# EAGLE schematic control (EAGLE 7.6.0)
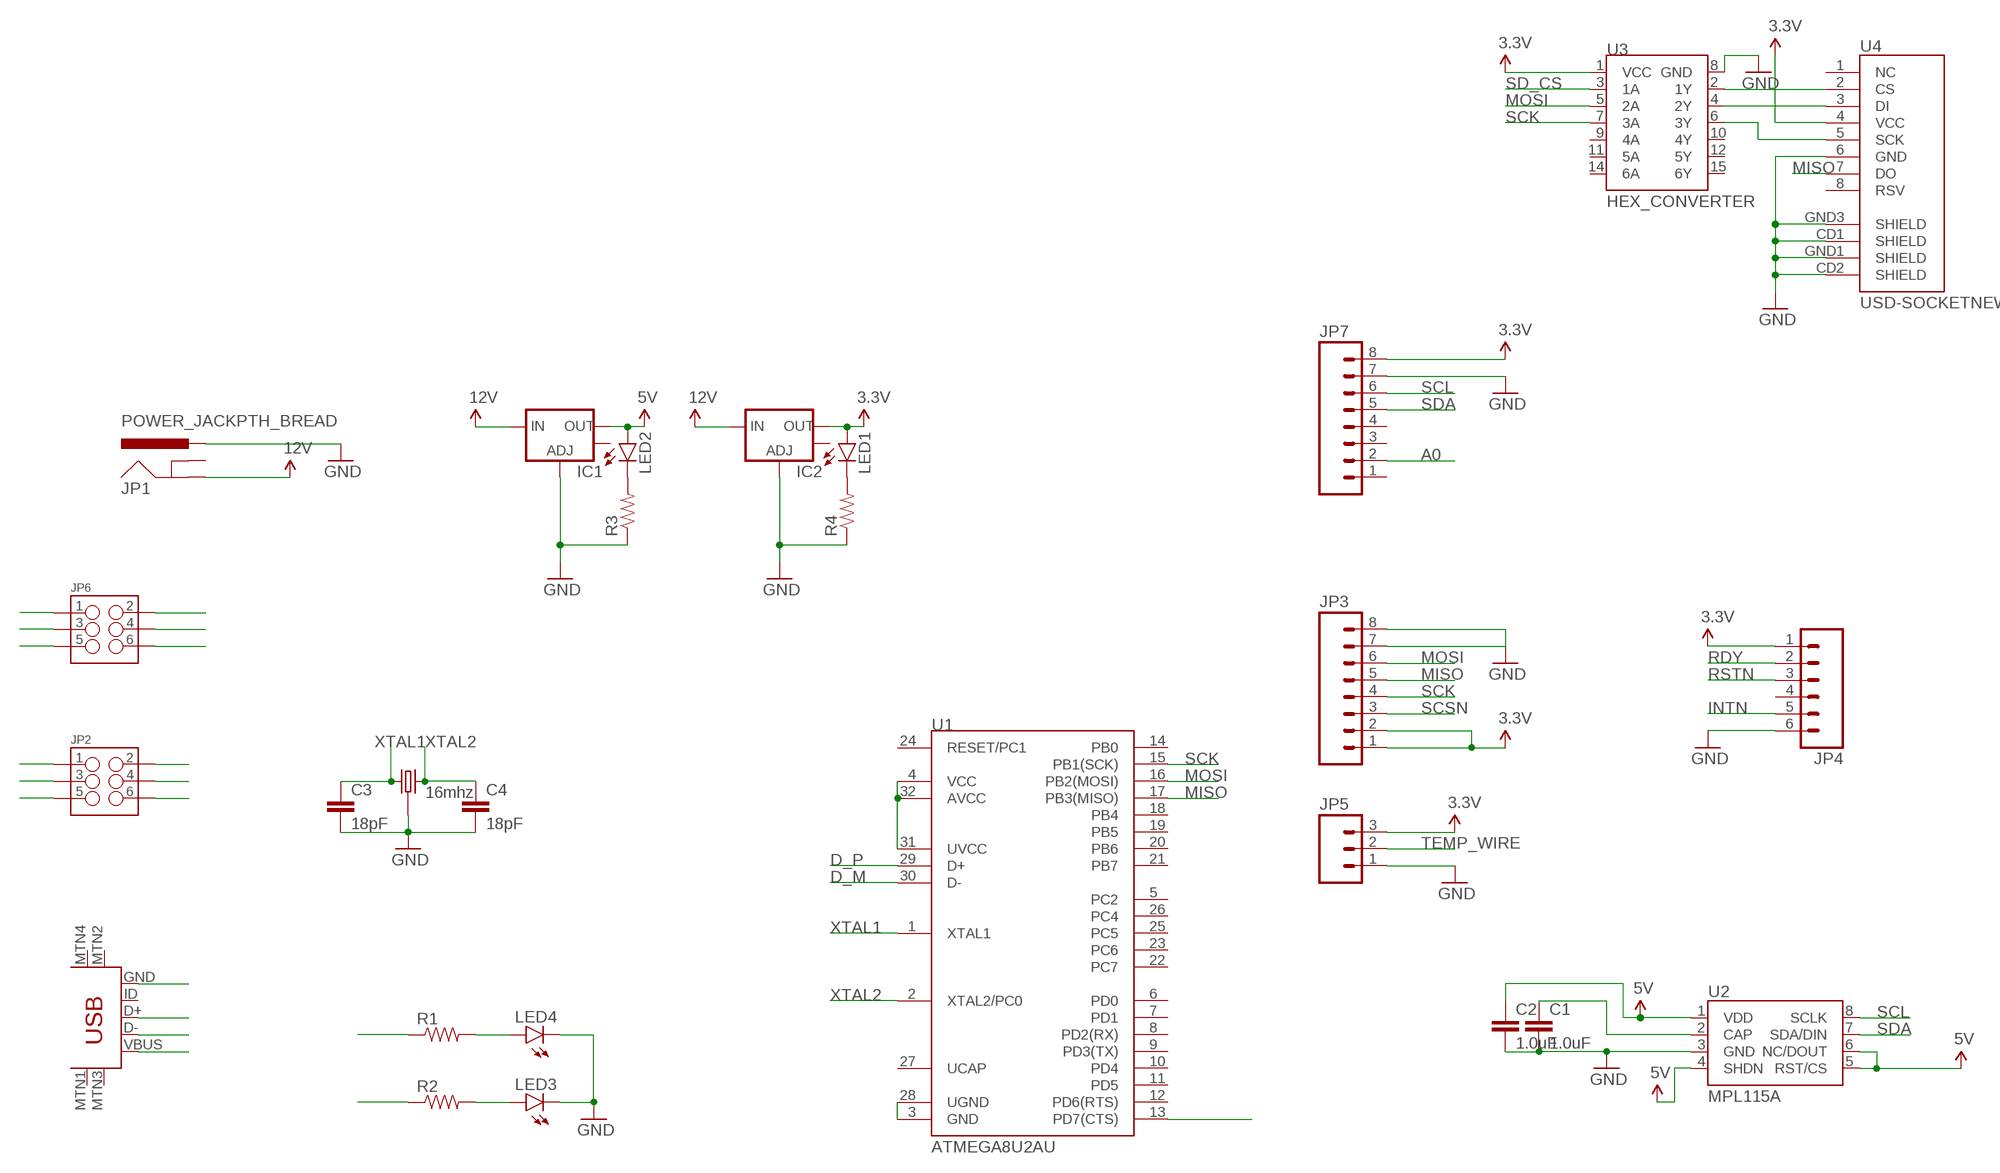
[diagram p0: schematic, sheet 1]

## Parts
C1  1.0uF  1.0UF-16V-10%(0603)  [0603-CAP]
C2  1.0uF  1.0UF-16V-10%(0603)  [0603-CAP]
C3  18pF  18PF-50V-5%(0603)  [0603-CAP]
C4  18pF  18PF-50V-5%(0603)  [0603-CAP]
IC1  V_REG_LM1117SOT223  [SOT223]
IC2  V_REG_LM1117SOT223  [SOT223]
JP1  POWER_JACKPTH_BREAD  [POWER_JACK_PTH_BREAD]
JP2  M03X2SHROUD  [2X3-SHROUDED]
JP3  M08  [1X08_ROUND]
JP4  M06SILK_FEMALE_PTH  [1X06]
JP5  M03PTH  [1X03]
JP6  M03X2SHROUD  [2X3-SHROUDED]
JP7  M08  [1X08_ROUND]
LED1  LED0603  [LED-0603]
LED2  LED0603  [LED-0603]
LED3  LED0603  [LED-0603]
LED4  LED0603  [LED-0603]
R1  RESISTOR0603-RES  [0603-RES]
R2  RESISTOR0603-RES  [0603-RES]
R3  RESISTOR0603-RES  [0603-RES]
R4  RESISTOR0603-RES  [0603-RES]
U1  ATMEGA8U2AU  [TQFP32-08]
U2  MPL115A  [LGA8]
U3  HEX_CONVERTER  [SO016]
U4  USD-SOCKETNEW  [MICRO-SD-SOCKET-PP]
U$3  16mhz  CRYSTAL-GROUNDED  [CRYSTAL-SMD-5X3]
U$5  USB-MINIB-5PIN  [USB-MINIB]

## Nets
3.3V: IC2.2(OUT) JP3.1 JP3.2 JP4.1 JP5.3 JP7.8 LED1.A U3.1(VCC) U4.4(VCC)
5V: C2.1 IC1.2(OUT) LED2.A U2.1(VDD) U2.4(SHDN) U2.5(RST/CS) U2.6(NC/DOUT)
12V: IC1.3(IN) IC2.3(IN) JP1.GND
A0: JP7.2
D_M: U1.30(D-)
D_P: U1.29(D+)
GND: C1.2 C2.2 C3.2 C4.2 IC1.1(ADJ) IC2.1(ADJ) JP1.PWR JP4.6 JP5.1 JP7.7 LED3.C LED4.C R3.1 R4.1 U2.3(GND) U3.8(GND) U4.6(GND) U4.CD1(SHIELD) U4.CD2(SHIELD) U4.GND1(SHIELD) U4.GND3(SHIELD) U$3.2 U$3.4
INTN: JP4.5
MISO: JP3.5 U1.17(PB3(MISO)) U4.7(DO)
MOSI: JP3.6 U1.16(PB2(MOSI)) U3.5(2A)
N$1: JP3.7 JP3.8
N$2: LED4.A R1.2
N$3: LED3.A R2.2
N$4: LED2.C R3.2
N$5: LED1.C R4.2
N$6: U3.2(1Y) U4.2(CS)
N$7: U$5.GND
N$8: U$5.D+
N$9: U$5.D-
N$10: U$5.VBUS
N$11: U3.4(2Y) U4.3(DI)
N$12: U3.6(3Y) U4.5(SCK)
N$15: C1.1 U2.2(CAP)
N$16: R1.1
N$17: R2.1
N$18: JP2.6
N$19: JP2.4
N$20: JP2.2
N$21: JP2.1
N$22: JP2.3
N$23: JP2.5
N$24: JP6.5
N$25: JP6.3
N$26: JP6.1
N$27: JP6.2
N$28: JP6.4
N$29: JP6.6
N$30: U1.3(GND) U1.28(UGND)
N$31: U1.4(VCC) U1.31(UVCC) U1.32(AVCC)
N$32: U1.13(PD7(CTS))
RDY: JP4.2
RSTN: JP4.3
SCK: JP3.4 U1.15(PB1(SCK)) U3.7(3A)
SCL: JP7.6 U2.8(SCLK)
SCSN: JP3.3
SD_CS: U3.3(1A)
SDA: JP7.5 U2.7(SDA/DIN)
TEMP_WIRE: JP5.2
XTAL1: C3.1 U1.1(XTAL1) U$3.3
XTAL2: C4.1 U1.2(XTAL2/PC0) U$3.1
Unconnected: IC1.4(OUT) IC2.4(OUT) JP1.GNDBREAK JP4.4 JP7.1 JP7.3 JP7.4 U1.5(PC2) U1.6(PD0) U1.7(PD1) U1.8(PD2(RX)) U1.9(PD3(TX)) U1.10(PD4) U1.11(PD5) U1.12(PD6(RTS)) U1.14(PB0) U1.18(PB4) U1.19(PB5) U1.20(PB6) U1.21(PB7) U1.22(PC7) U1.23(PC6) U1.24(RESET/PC1) U1.25(PC5) U1.26(PC4) U1.27(UCAP) U3.9(4A) U3.10(4Y) U3.11(5A) U3.12(5Y) U3.14(6A) U3.15(6Y) U4.1(NC) U4.8(RSV) U$5.ID U$5.MTN1(MTN2) U$5.MTN2(MTN3) U$5.MTN3(MTN1) U$5.MTN4

## Library data of the parts
C1 C2 = SparkFun-Capacitors:1.0UF-16V-10%(0603): CAP-00868; PROD_ID: CAP-00868
C3 C4 = SparkFun-Capacitors:18PF-50V-5%(0603): CAP-08267; PROD_ID: CAP-08267
IC1 IC2 = SparkFun-PowerIC:V_REG_LM1117: Voltage Regulator LM1117 Standard adjustable voltage regulator but in SMD form. Spark Fun Electronics SKU : COM-00595; PROD_ID: VREG-08170
JP1 = SparkFun-Connectors:POWER_JACK: Power Jack This is the standard 5.5mm barrel jack for power. The PTH is the most common, proven, reliable, footprint. The Slot footprint only works if the mill layer is transmitted to the PCB fab house so be warned. Mating wall wart : TOL-00298 (and others); PROD_ID: PRT-10811
JP2 JP6 = SparkFun-Connectors:M03X2: 2x3 .1" header. Shrouded, with keying- CONN-10681 SMT- CONN-11415 Pogo pins- HW-11044; PROD_ID: CONN-10681
JP3 JP7 = SparkFun-Connectors:M08: Header 8 Standard 8-pin 0.1" header. Use with straight break away headers (SKU : PRT-00116), right angle break away headers (PRT-00553), swiss pins (PRT-00743), machine pins (PRT-00117), and female headers (PRT-00115).
JP4 = SparkFun-Connectors:M06: Header 6 Standard 6-pin 0.1" header. Use with straight break away headers (SKU : PRT-00116), right angle break away headers (PRT-00553), swiss pins (PRT-00743), machine pins (PRT-00117), and female headers (PRT-00115). Molex polarized connector foot print use with SKU : PRT-08094 with associated crimp pins and housings. NOTES ON THE VARIANTS LOCK and LOCK_LONGPADS... This footprint was designed to help hold the alignment of a through-hole component (i.e. 6-pin header) while soldering it into place. You may notice that each hole has been shifted either up or down by 0.005 of an inch from it's more standard position (which is a perfectly straight line). This slight alteration caused the pins (the squares in the middle) to touch the edges of the holes. Because they are alternating, it causes a "brace" to hold the component in place. 0.005 has proven to be the perfect amount of "off-center" position when using our standard breakaway headers. Although looks a little odd when you look at the bare footprint, once you have a header in there, the alteration is very hard to notice. Also,if you push a header all the way into place, it is covered up entirely on the bottom side. This idea of altering the position of holes to aid alignment will be further integrated into the Sparkfun Library for other footprints. It can help hold any component with 3 or more connection pins.; PROD_ID: CONN-08437
JP5 = SparkFun-Connectors:M03: Header 3 Standard 3-pin 0.1" header. Use with straight break away headers (SKU : PRT-00116), right angle break away headers (PRT-00553), swiss pins (PRT-00743), machine pins (PRT-00117), and female headers (PRT-00115). Molex polarized connector foot print use with SKU : PRT-08232 with associated crimp pins and housings.
LED1-LED4 = SparkFun-LED:LED: LEDs Standard schematic elements and footprints for 5mm, 3mm, 1206, and 0603 sized LEDs. 5mm - Spark Fun Electronics SKU : COM-00529 (and others)
R1-R4 = SparkFun-Passives:RESISTOR: Resistor Basic schematic elements and footprints for 0603, 1206, and PTH resistors.
U1 = SparkFun-DigitalIC:ATMEGA8U2: Atmel 32-pin 8-bit Microcontroller with 8/16/32K Bystes of ISP Flash and USB Controller. ATmega8U2, ATmega16U2, and ATmega32U2
U2 = SparkFun-Sensors:MPL115A: MPL115A1 (SPI) and MPL115A2 (I2C) Miniature Digital Barometer 5.0x3.0x1.2mm LGA Package
U3 = SparkFun-DigitalIC:HEX_CONVERTER: 74HC4050 Hex Buffer Level Shifter SMD SO016; PROD_ID: IC-09604
U4 = SparkFun-Connectors:USD-SOCKET: microSD Socket Push-push type uSD socket. Schematic element and footprint production proven. Spark Fun Electronics SKU : PRT-00127. tDoc lines correctly indicate media card edge positions when inserting (unlocked, locked, depressed).; PROD_ID: CONN-07820
U$3 = SparkFun-FreqCtrl:CRYSTAL-GROUNDED
U$5 = SparkFun-Connectors:USB-MINIB: Mini-USB "B" connector with 5th pin broken out. Created new symbol breaking out 5th "ID" pin in mini/micro USB connector spec. See: http://en.wikipedia.org/wiki/Mini_usb#Cables. Uses same footprint as 4-pin symbol. Also added pins to connect to mounting / shield pads if required (probably not generally needed as signals aren't shielded once they leave the connector).